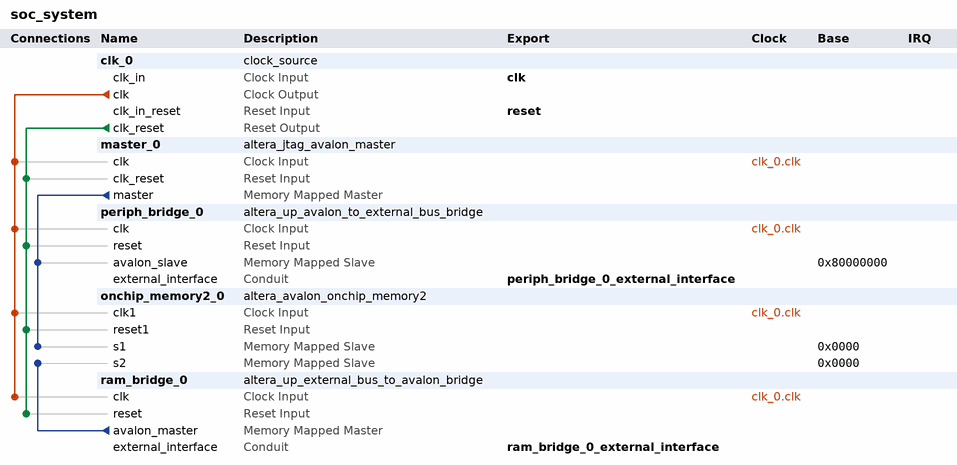
[diagram p0: system contents]
# Platform Designer (Qsys) system soc_system, Cyclone V 5CSXFC6D6F31C6
# Parameters at their usual value, and those the tool derives, are not listed.
package require -exact qsys 18.1
create_system soc_system
set_project_property DEVICE_FAMILY {Cyclone V}
set_project_property DEVICE 5CSXFC6D6F31C6

add_instance clk_0 clock_source 18.1
set_instance_parameter_value clk_0 clockFrequency 50000000

add_instance master_0 altera_jtag_avalon_master 18.1

add_instance periph_bridge_0 altera_up_avalon_to_external_bus_bridge 18.0
set_instance_parameter_value periph_bridge_0 addr_size 256
set_instance_parameter_value periph_bridge_0 addr_size_multiplier bytes
set_instance_parameter_value periph_bridge_0 data_size 32

add_instance onchip_memory2_0 altera_avalon_onchip_memory2 18.1
set_instance_parameter_value onchip_memory2_0 dataWidth 32
set_instance_parameter_value onchip_memory2_0 dualPort true
set_instance_parameter_value onchip_memory2_0 initMemContent true
set_instance_parameter_value onchip_memory2_0 initializationFileName onchip_mem.hex
set_instance_parameter_value onchip_memory2_0 memorySize 65536
set_instance_parameter_value onchip_memory2_0 singleClockOperation true

add_instance ram_bridge_0 altera_up_external_bus_to_avalon_bridge 18.0
set_instance_parameter_value ram_bridge_0 addr_size 1024
set_instance_parameter_value ram_bridge_0 addr_size_multiplier Mbytes
set_instance_parameter_value ram_bridge_0 data_size 32

# connections
add_connection clk_0.clk master_0.clk clock
add_connection clk_0.clk onchip_memory2_0.clk1 clock
add_connection clk_0.clk periph_bridge_0.clk clock
add_connection clk_0.clk ram_bridge_0.clk clock
add_connection clk_0.clk_reset master_0.clk_reset reset
add_connection clk_0.clk_reset onchip_memory2_0.reset1 reset
add_connection clk_0.clk_reset periph_bridge_0.reset reset
add_connection clk_0.clk_reset ram_bridge_0.reset reset
add_connection master_0.master onchip_memory2_0.s1 avalon
set_connection_parameter_value master_0.master/onchip_memory2_0.s1 baseAddress 0x0000
add_connection master_0.master periph_bridge_0.avalon_slave avalon
set_connection_parameter_value master_0.master/periph_bridge_0.avalon_slave baseAddress 0x80000000
add_connection ram_bridge_0.avalon_master onchip_memory2_0.s2 avalon
set_connection_parameter_value ram_bridge_0.avalon_master/onchip_memory2_0.s2 baseAddress 0x0000

# exported interfaces
add_interface clk clock sink
set_interface_property clk EXPORT_OF clk_0.clk_in
add_interface periph_bridge_0_external_interface conduit end
set_interface_property periph_bridge_0_external_interface EXPORT_OF periph_bridge_0.external_interface
add_interface ram_bridge_0_external_interface conduit end
set_interface_property ram_bridge_0_external_interface EXPORT_OF ram_bridge_0.external_interface
add_interface reset reset sink
set_interface_property reset EXPORT_OF clk_0.clk_in_reset

set_interconnect_requirement {$system} qsys_mm.clockCrossingAdapter HANDSHAKE
set_interconnect_requirement {$system} qsys_mm.enableEccProtection FALSE
set_interconnect_requirement {$system} qsys_mm.insertDefaultSlave FALSE
set_interconnect_requirement {$system} qsys_mm.maxAdditionalLatency 1

save_system soc_system.qsys
